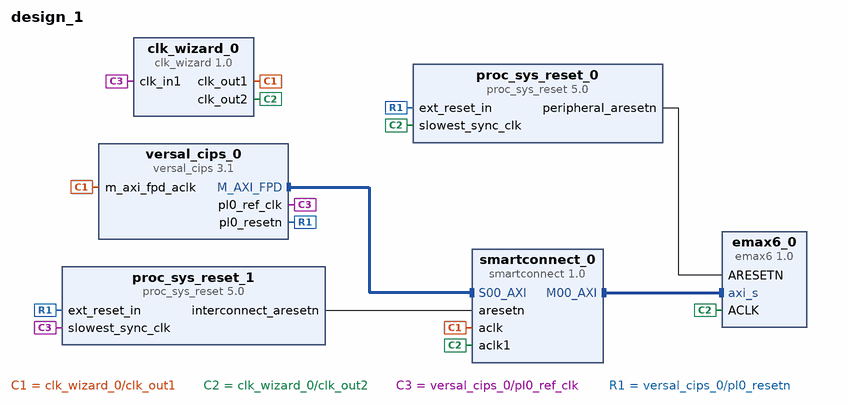
[diagram p0: block diagram of the top level]
# Vivado block design design_1, xcvm1802-vsva2197-2MP-e-S, Vivado 2021.2
create_bd_design design_1

create_bd_cell -type ip -vlnv xilinx.com:ip:versal_cips:3.1 versal_cips_0
set_property -dict [list \
  CONFIG.CLOCK_MODE {REF CLK 33.33 MHz} \
  CONFIG.PS_PL_CONNECTIVITY_MODE Custom \
  CONFIG.PS_PMC_CONFIG {CLOCK_MODE {REF CLK 33.33 MHz} PMC_ALT_REF_CLK_FREQMHZ 33.333 PMC_CRP_EFUSE_REF_CTRL_SRCSEL IRO_CLK/4 PMC_CRP_HSM0_REF_CTRL_FREQMHZ 33.333 PMC_CRP_HSM1_REF_CTRL_FREQMHZ 133.333 PMC_CRP_LSBUS_REF_CTRL_FREQMHZ 100 PMC_CRP_NOC_REF_CTRL_FREQMHZ 960 PMC_CRP_PL0_REF_CTRL_FREQMHZ 100 PMC_CRP_PL5_REF_CTRL_FREQMHZ 400 PMC_PL_ALT_REF_CLK_FREQMHZ 33.333 PS_GEN_IPI_PMCNOBUF_ENABLE 0 PS_GEN_IPI_PMC_ENABLE 0 PS_GEN_IPI_PSM_ENABLE 0 PS_NUM_FABRIC_RESETS 1 PS_PL_CONNECTIVITY_MODE Custom PS_USE_M_AXI_FPD 1 PS_USE_PMCPL_CLK0 1 PS_USE_PMCPL_IRO_CLK 1 SMON_ALARMS Set_Alarms_On SMON_ENABLE_TEMP_AVERAGING 0 SMON_TEMP_AVERAGING_SAMPLES 0 } \
  CONFIG.PS_PMC_CONFIG_APPLIED 1 \
] [get_bd_cells versal_cips_0]
create_bd_cell -type ip -vlnv xilinx.com:ip:proc_sys_reset:5.0 proc_sys_reset_0
create_bd_cell -type ip -vlnv xilinx.com:ip:proc_sys_reset:5.0 proc_sys_reset_1
create_bd_cell -type ip -vlnv xilinx.com:ip:clk_wizard:1.0 clk_wizard_0
set_property -dict [list \
  CONFIG.CLKOUT_DRIVES BUFG,BUFG,BUFG,BUFG,BUFG,BUFG,BUFG \
  CONFIG.CLKOUT_DYN_PS None,None,None,None,None,None,None \
  CONFIG.CLKOUT_GROUPING Auto,Auto,Auto,Auto,Auto,Auto,Auto \
  CONFIG.CLKOUT_MATCHED_ROUTING false,false,false,false,false,false,false \
  CONFIG.CLKOUT_PORT clk_out1,clk_out2,clk_out3,clk_out4,clk_out5,clk_out6,clk_out7 \
  CONFIG.CLKOUT_REQUESTED_DUTY_CYCLE 50.000,50.000,50.000,50.000,50.000,50.000,50.000 \
  CONFIG.CLKOUT_REQUESTED_OUT_FREQUENCY 300,200,100.000,100.000,100.000,100.000,100.000 \
  CONFIG.CLKOUT_REQUESTED_PHASE 0.000,0.000,0.000,0.000,0.000,0.000,0.000 \
  CONFIG.CLKOUT_USED true,true,false,false,false,false,false \
] [get_bd_cells clk_wizard_0]
create_bd_cell -type ip -vlnv xilinx.com:ip:smartconnect:1.0 smartconnect_0
set_property -dict {CONFIG.NUM_CLKS 2 CONFIG.NUM_SI 1} [get_bd_cells smartconnect_0]
create_bd_cell -type ip -vlnv comparch:user:emax6:1.0 emax6_0

# ---- connections ----

connect_bd_intf_net [get_bd_intf_pins smartconnect_0/M00_AXI] [get_bd_intf_pins emax6_0/axi_s]
connect_bd_intf_net [get_bd_intf_pins smartconnect_0/S00_AXI] [get_bd_intf_pins versal_cips_0/M_AXI_FPD]
connect_bd_net [get_bd_pins clk_wizard_0/clk_out1] [get_bd_pins versal_cips_0/m_axi_fpd_aclk] [get_bd_pins smartconnect_0/aclk]
connect_bd_net [get_bd_pins clk_wizard_0/clk_out2] \
  [get_bd_pins smartconnect_0/aclk1] [get_bd_pins proc_sys_reset_0/slowest_sync_clk] [get_bd_pins emax6_0/ACLK]
connect_bd_net [get_bd_pins proc_sys_reset_0/peripheral_aresetn] [get_bd_pins emax6_0/ARESETN]
connect_bd_net [get_bd_pins proc_sys_reset_1/interconnect_aresetn] [get_bd_pins smartconnect_0/aresetn]
connect_bd_net [get_bd_pins versal_cips_0/pl0_ref_clk] [get_bd_pins clk_wizard_0/clk_in1] [get_bd_pins proc_sys_reset_1/slowest_sync_clk]
connect_bd_net [get_bd_pins versal_cips_0/pl0_resetn] [get_bd_pins proc_sys_reset_0/ext_reset_in] [get_bd_pins proc_sys_reset_1/ext_reset_in]

# ---- address map ----
assign_bd_address -offset 0x40000000000 -range 4G -target_address_space [get_bd_addr_spaces versal_cips_0/M_AXI_FPD] [get_bd_addr_segs emax6_0/axi_s/reg0]

validate_bd_design
save_bd_design
